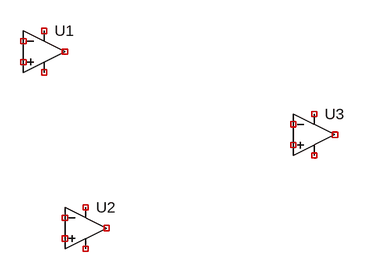
[diagram p0: schematic Draft8.asc]
Draft8.asc, the LTspice schematic file:
Version 4
SHEET 1 880 680
SYMBOL Opamps\\UniversalOpamp2 48 272 R0
SYMATTR InstName U2
SYMBOL Opamps\\UniversalOpamp2 400 128 R0
SYMATTR InstName U3
SYMBOL Opamps\\UniversalOpamp2 -16 0 R0
SYMATTR InstName U1

The netlist it stands for:
* Draft8.asc
XU2 NC_01 NC_02 NC_03 NC_04 NC_05 level.2 Avol=1Meg GBW=10Meg Slew=10Meg ilimit=25m rail=0 Vos=0 phimargin=45 en=0 enk=0 in=0 ink=0 Rin=500Meg  ; pins IN+ IN- V+ V- OUT
XU3 NC_06 NC_07 NC_08 NC_09 NC_10 level.2 Avol=1Meg GBW=10Meg Slew=10Meg ilimit=25m rail=0 Vos=0 phimargin=45 en=0 enk=0 in=0 ink=0 Rin=500Meg  ; pins IN+ IN- V+ V- OUT
XU1 NC_11 NC_12 NC_13 NC_14 NC_15 level.2 Avol=1Meg GBW=10Meg Slew=10Meg ilimit=25m rail=0 Vos=0 phimargin=45 en=0 enk=0 in=0 ink=0 Rin=500Meg  ; pins IN+ IN- V+ V- OUT
.lib UniversalOpamps2.sub
.backanno
.end